# Altium project High_frequency_project.PrjPcb
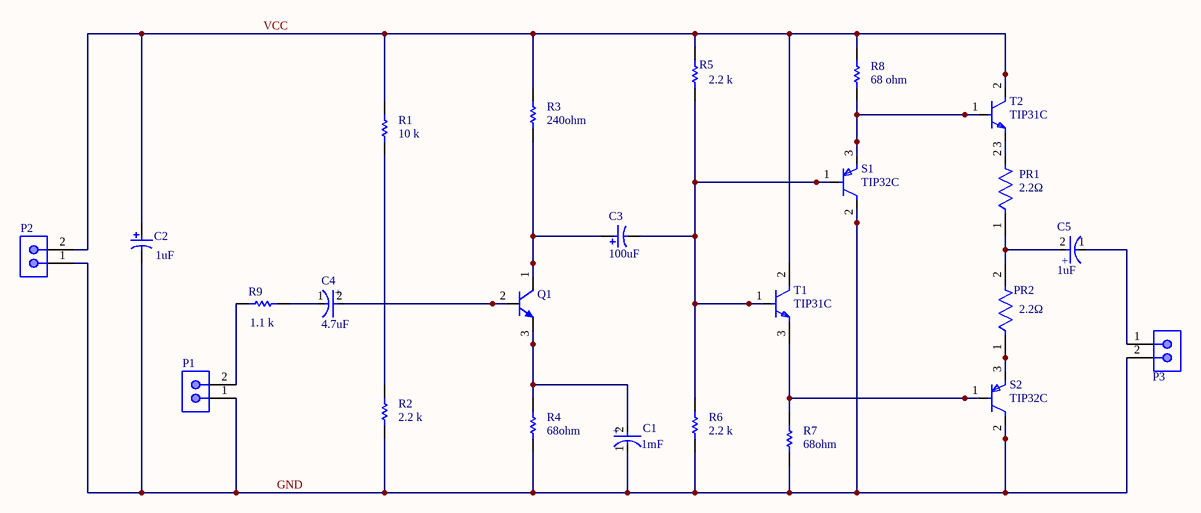
[diagram p0: High_freq.SchDoc]
1 sheet, 24 parts. Net scope: global (net labels, ports and power ports of the same name join across sheets).
Board file: High_freq_final.PcbDoc

## Sheet High_freq.SchDoc
size A; SheetNumber: 1; SheetTotal: 1

### Parts
C1  Capacitance: 1mF  [FP-RAD-TH-D_10_0_5-L_16_1-MFG]  (hidden comment: EEUFK1C102)
C2  cap: 1uF  [CAPPR55-250-1120X630X1220]  (hidden comment: ECA-1VM101)
C3  cap: 100uF  [CAPPR55-250-1120X630X1220]  (hidden comment: ECA-1VM101)
C4  Capacitance: 4.7uF  [FP-RAD-TH-D_6_3_0_5-L_7_1-MFG]  (hidden comment: EEAGA1A470)
C5  Capacitance: 1uF  [FP-RAD-TH-D_6_3_0_5-L_7_1-MFG]  (hidden comment: EEAGA1A470)
P1  22-27-2021  [MOLX-22-27-2021_V]  (value not drawn)
P2  22-27-2021  [MOLX-22-27-2021_V]  (value not drawn)
P3  22-27-2021  [MOLX-22-27-2021_V]  (value not drawn)
PR1  Resistance: 2.2Ω  [FP-SQP500-MFG]  (hidden comment: SQP500JB-1R2)
PR2  Resistance: 2.2Ω  [FP-SQP500-MFG]  (hidden comment: SQP500JB-1R2)
Q1  BC547BRL1G  [ONSC-TO-92-3-29-11_AM_BL]  (value not drawn)
R1  Resistance: 10 k  [RESA60-630X240]  (hidden comment: MFR-25FBF52-1K)
R2  Resistance: 2.2 k  [RESA60-630X240]  (hidden comment: MFR-25FBF52-1K)
R3  Resistance: 240ohm  [RESA60-630X240]  (hidden comment: MFR-25FBF52-1K)
R4  Resistance: 68ohm  [RESA60-630X240]  (hidden comment: MFR-25FBF52-1K)
R5  Resistance: 2.2 k  [RESA60-630X240]  (hidden comment: MFR-25FBF52-1K)
R6  Resistance: 2.2 k  [RESA60-630X240]  (hidden comment: MFR-25FBF52-1K)
R7  Resistance: 68ohm  [RESA60-630X240]  (hidden comment: MFR-25FBF52-1K)
R8  Resistance: 68 ohm  [RESA60-630X240]  (hidden comment: MFR-25FBF52-1K)
R9  Resistance: 1.1 k  [RESA60-630X240]  (hidden comment: MFR-25FBF52-1K)
S1  TIP32C  [FP-TO-220-P0A0015988-MFG]
S2  TIP32C  [FP-TO-220-P0A0015988-MFG]
T1  TIP31C  [FP-TO-220-P0A0015988-MFG]
T2  TIP31C  [FP-TO-220-P0A0015988-MFG]

### Nets
GND: C1.1(C) C2.2 P1.1 P2.1 P3.2 R2.1 R4.1 R6.1 R7.1 S1.2(C) S2.2(C)
VCC: C2.1 P2.2 R1.2 R3.2 R5.2 R8.2 T1.2(C) T2.2(C)
NetC1_2: C1.2(A) Q1.3(E) R4.2
NetC3_1: C3.1 Q1.1(C) R3.1
NetC3_2: C3.2 R5.1 R6.2 S1.1(B) T1.1(B)
NetC4_1: C4.1(C) R9.1
NetC4_2: C4.2(A) Q1.2(B)
NetC5_1: C5.1(C) P3.1
NetC5_2: C5.2(A) PR1.1 PR2.2
NetP1_2: P1.2 R9.2
NetPR1_2: PR1.2 T2.3(E)
NetPR2_1: PR2.1 S2.3(E)
NetR1_1: R1.1 R2.2
NetR7_2: R7.2 S2.1(B) T1.3(E)
NetR8_1: R8.1 S1.3(E) T2.1(B)

### Notes on the sheet
- (in symbol CMP-05427-001094-1) +
- (in symbol CMP-05427-001760-1) +

### Library data of the parts
C1 = CMP-05427-001094-1: Aluminum Electrolytic Capacitors (Radial Lead Type) AEC-Q200 Qualified 1000uF ±20% 16V; Dielectric Material: Aluminium; Ripple Current: 1.24A; Life (Hours): 4000Hour; Lead Diameter: 0.6mm; Impedance: 49mR; Case/Package: Radial; Max Operating Temperature: 105°C; Diameter: 10mm; Termination: Radial; Series: FK Radial; REACH SVHC: No SVHC; Voltage: 16V; Tolerance: 20%; Min Operating Temperature: -55°C; Packaging: Bulk; Mount: Through Hole; Radiation Hardening: No; Construction: RADIAL; Height: 16mm; RoHS Compliant: Yes; Voltage Rating (DC): 16V; Lead Pitch: 5mm; Number of Pins: 2; Voltage Rating: 16V
C2 C3 = CMP-1665-00015-4: Aluminum Electrolytic Capacitor (Radial Lead Type), 100 uF, 35 V, -40 to 85 degC, 2-Pin THD, RoHS, Bulk; Manufacturer: Panasonic; Voltage Rating: 35 V; PackageReference: Radial; ComponentLink2URL: http://industrial.panasonic.com/cdbs/www-data/pdf/RDF0000/ABA0000C1047.pdf; DatasheetVersion: 03/2016; REACH SVHC: No SVHC; Mounting Technology: Through Hole; ComponentLink2Description: Datasheet; Packaging: Bulk; Lead Pitch: 2.5 mm; Height: 11.2 mm; Pins: 2; RoHSCompliant: true; Mount: Through Hole; Package Quantity: 200; Min Operating Temperature: -40 degC; Max Operating Temperature: 85 degC; PackageDescription: 2-Pin Through Hole Device, Dia 6.3 mm, Body Length 11.2 mm; ComponentLink1Description: Manufacturer URL; Length: 11.2 mm; ComponentLink1URL: http://www.panasonic.com/
C4 C5 = CMP-05427-001760-1: Aluminum Electrolytic Capacitors (Radial Lead Type) 47uF ±20% 10V; Lead Diameter: 0.45mm; Ripple Current: 65mA; Leakage Current: 4.7uA; Life (Hours): 1000Hour; Polarity: Polar; Length: 7mm; Series: GA; REACH SVHC: No SVHC; Packaging: Bulk; Lead Pitch: 2.5mm; Termination: Radial; Radiation Hardening: No; RoHS Compliant: Yes; Diameter: 6.3mm; Max Operating Temperature: 105°C; Voltage Rating (DC): 10V; Height: 7mm; Construction: RADIAL; Height - Seated (Max): 0.276inch; Package Quantity: 200; Case/Package: Radial; Voltage: 10V; Voltage Rating: 10V; Tolerance: 20%; Number of Pins: 2; Mount: Through Hole; Min Operating Temperature: -55°C
P1-P3 = CMP-2000-05537-1: Male Header, Pitch 2.54 mm, 1 x 2 Position, Height 11.7 mm, Tail Length 3.56 mm, 0 to 75 degC, RoHS, Bulk; Manufacturer: Molex; PartNumber: 0022272021; Current rating: 4A; Package Version: Rev. BC, 02/2012; Voltage rating: 250V; No. of Positions: 2; Pitch: 2.54mm; No. of Rows: 1; Orientation: Vertical; Operating temperature: 0°Cto+75°C; Manufacturer URL: http://www.molex.com/; Mounting Technology: ThroughHole; Housing material: Nylon(UL94V-0); Package Description: 2-Leads Header, Body 5.08 x 5.8 mm, Pitch 2.54 mm; Voltage - Max: 250V; Datasheet URL: http://www.molex.com/pdm_docs/sd/022272021_sd.pdf; Package Reference: 22-27-2021; Contact material: Tinplatedbrass; Current - Max: 4A; Datasheet Version: Rev. F, 06/2009
PR1 PR2 = CMP-03413-000003-1: RES 1.2 OHM 5W 5% AXIAL; Manufacturer: Yageo; Temperature Coefficient: 300ppm/°C; Value: 1.2Ω; Voltage Rating: 350V; Lead Free: Yes; Package: SQP500; Composition: Wirewound; Series: SQP; Temperature: -55°C to +155°C; Device Class L2: Resistors; Digikey Description: RES 1.2 OHM 5W 5% AXIAL; RoHS: TRUE; Device Class L3: Through-Hole Resistors; ComponentLink2Description: Datasheet; ComponentLink2URL: https://datasheet.ciiva.com/2723/yageolr-sqpnsp-2013-2723111.pdf; Temperature Range High: +155°C; Manufacturer Part Number: SQP500JB-1R2; Octopart: https://octopart.com/sqp500jb-1r2-yageo-1162571; Device Class L1: Passive Components; Tolerance: 5%; Height: 10mm; Category: Res; Ipc Land Pattern Name: RESAD2911W100L2350D1050; Automotive: No; Power Rating: 5W; Temperature Range Low: -55°C
Q1 = CMP-1048-01605-1: Amplifier Transistor, NPN Silicon, 3-Pin TO-92, Pb-Free, Tape and Reel; Manufacturer: On Semiconductor; IC Continuous (A): 0.1; fT Min (MHz): 150; ComponentLink2URL: http://www.onsemi.com/pub_link/Collateral/BC546-D.PDF; ComponentLink1URL: http://www.onsemi.com/; ComponentLink2Description: Datasheet; RoHS: TRUE; ComponentLink3Description: Package Specification; ComponentLink1Description: Manufacturer URL; ComponentLink3URL: http://www.onsemi.com/pub_link/Collateral/MAC97-D.PDF; PackageDescription: 3-Pin Transistor Outline, Body 4.825 x 3.685 mm, Pitch 1.27 mm; Packing: Tape and Reel; PackageVersion: Rev. AM; Polarity: NPN; DatasheetVersion: Rev. 7; Mounting Technology: Through Hole; PackageReference: TO-92-3-29-11_AM_BL; PartNumber: BC547BRL1G
R1-R9 = CMP-1659-00075-1: Axial Resistor, 1 KOhm, +/- 1%, 250 mW, -55 to 155 degC, 2-Pin THD, RoHS, Bulk; Voltage Rating: 250 V; Power Rating: 250 mW; ComponentLink2Description: Datasheet; RoHSCompliant: true; PackageReference: MFR-25; Case\Package: Axial; Max Operating Temperature: 155 degC; DatasheetVersion: Apr-13; Tolerance: 1%; ComponentLink1URL: http://www.yageo.com/; Length: 0.248 inch; ComponentLink2URL: http://www.yageo.com/documents/recent/Yageo%20LR_MFR_2013.pdf; Packaging: Bulk; Package Quantity: 200; PackageDescription: 2-Pin Axial Lead, Dia 2.4 mm, Body Length 6.3 mm; Min Operating Temperature: -55 degC; ComponentLink1Description: Manufacturer URL
S1 S2 = CMP-12195-000005-1: TRANS PNP 100V 3A TO-220; Manufacturer: STMicroelectronics; Standoff Height: 3.5mm; Number Of Pnp: 1; Max Collector Current: -3A; Emitter Base Voltage: -5V; Collector Emitter Voltage: -100V; Hfe Testvce: -4V; Hfe Max: 50; Collector Emitter Saturation Voltage: -1.2V; Power Dissipation: 2W; Max Junction Temp: +150°C; Hfe Min: 10; Device Class L3: BJTs; Mouser Description: Original ST Microelectronics Transistor, 100V, 3A, .22 Ohm, TO-220 Package; ComponentLink2Description: Datasheet; Device Class L1: Discrete Semiconductors; Automotive: No; Number Of Elements: 1; Category: Trans; Collector Base Voltage: -100V; Package: TO-220-P0A0015988; Height: 19.68mm; Lead Free: Yes; ComponentLink2URL: https://www.st.com/resource/en/datasheet/tip32c.pdf; Hfe Testic: -3A; RoHS: TRUE; Temperature Range High: +150°C; Temperature: to +150°C; Device Class L2: Transistors; Digikey Description: TRANS PNP 100V 3A TO-220; Octopart: https://octopart.com/tip32c-stmicroelectronics-353617; Manufacturer Part Number: TIP32C
T1 T2 = CMP-12195-000001-1: TRANS NPN 100V 3A TO-220; Manufacturer: STMicroelectronics; Hfe Max: 50; Number Of Npn: 1; Max Junction Temp: +150°C; Standoff Height: 3.5mm; Emitter Base Voltage: 5V; Collector Emitter Saturation Voltage: 1.2V; Power Dissipation: 2W; Hfe Testvce: 4V; Hfe Min: 10; Device Class L2: Transistors; ComponentLink2URL: https://www.st.com/resource/en/datasheet/tip31c.pdf; Device Class L1: Discrete Semiconductors; Digikey Description: TRANS NPN 100V 3A TO-220; Max Collector Current: 3A; RoHS: TRUE; Height: 19.68mm; Mouser Description: Bipolar Transistors - BJT NPN Gen Pur Power; Number Of Elements: 1; Package: TO-220-P0A0015988; Temperature: to +150°C; Octopart: https://octopart.com/tip31c-stmicroelectronics-15555; Manufacturer Part Number: TIP31C; Category: Trans; Hfe Testic: 3A; Lead Free: Yes; Collector Base Voltage: 100V; Device Class L3: BJTs; Collector Emitter Voltage: 100V; Automotive: No; ComponentLink2Description: Datasheet; Temperature Range High: +150°C